# EAGLE design fedpower_mic841_revf (EAGLE 7.2.0)
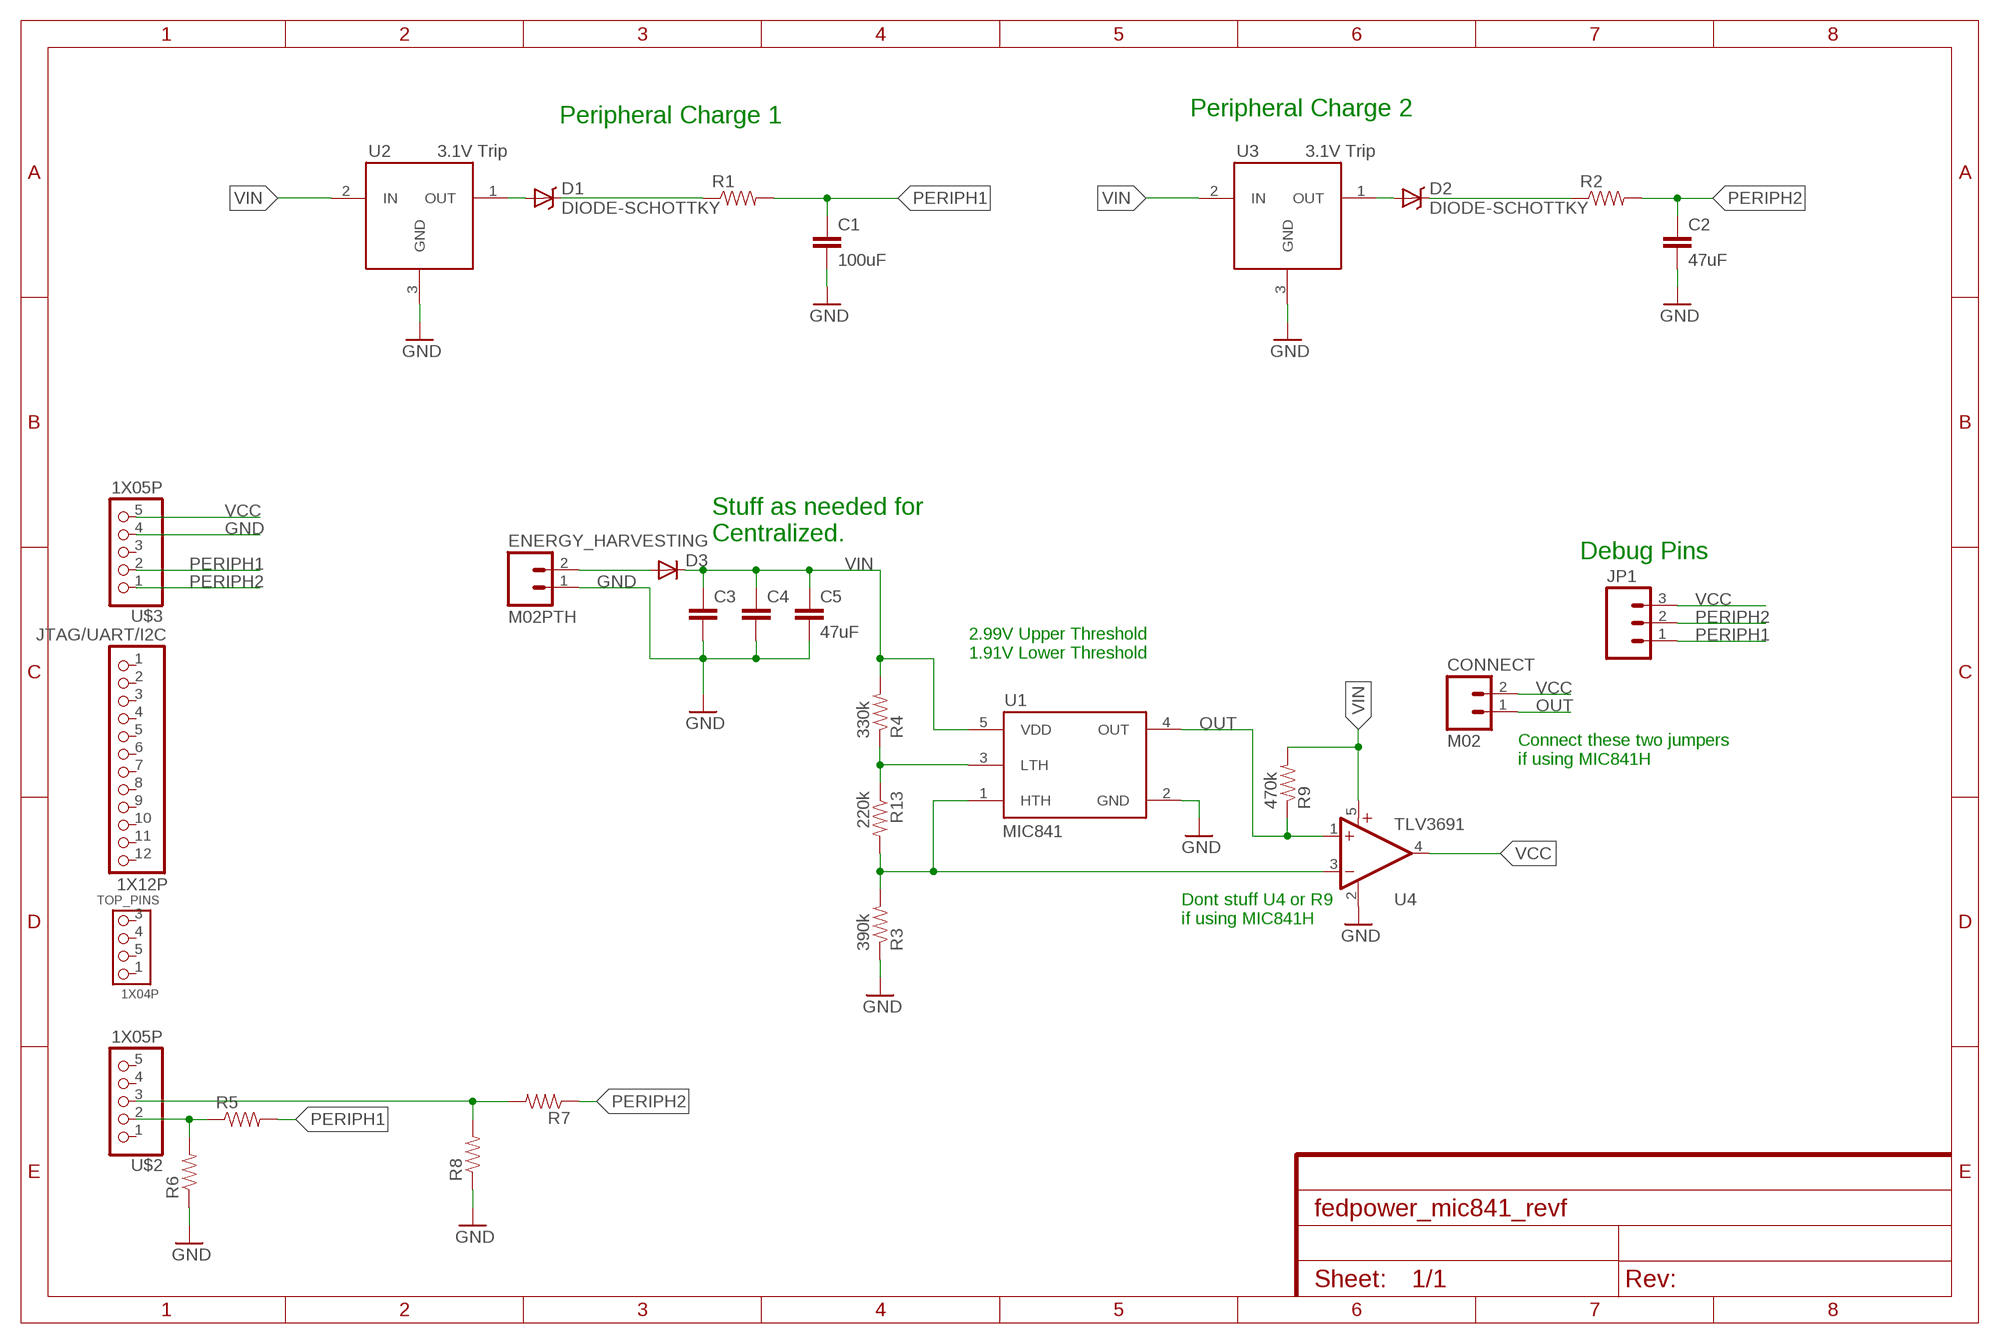
[diagram p0: schematic, sheet 1]
FRAME1 (FRAME-A4L): CNAME: Federated Power Board; CREVISION: C; DESIGNER: Josiah Hester

## Parts
C1  100uF  1.0UF-25V-+80/-20(0805)  [0805]
C2  47uF  1.0UF-25V-+80/-20(0805)  [0805]
C3  1.0UF-25V-+80/-20(0805)  [0805]
C4  1.0UF-25V-+80/-20(0805)  [0805]
C5  47uF  1.0UF-25V-+80/-20(0805)  [0805]
CONNECT  M02  [1X02-1.27MM]
D1  DIODE-SCHOTTKY  [SOD-323]
D2  DIODE-SCHOTTKY  [SOD-323]
D3  DIODESOD  [SOD-323]
ENERGY_HARVESTING  M02PTH  [1X02]
JP1  M03PTH  [1X03]
JTAG/UART/I2C  1X12P  [1X12P]
R1  0.3OHM-1/8W-1%(0805)  [0805]
R2  0.3OHM-1/8W-1%(0805)  [0805]
R3  390k  0.3OHM-1/8W-1%(0805)  [0805]
R4  330k  0.3OHM-1/8W-1%(0805)  [0805]
R5  0.3OHM-1/8W-1%(0805)  [0805]
R6  0.3OHM-1/8W-1%(0805)  [0805]
R7  0.3OHM-1/8W-1%(0805)  [0805]
R8  0.3OHM-1/8W-1%(0805)  [0805]
R9  470k  0.3OHM-1/8W-1%(0805)  [0805]
R13  220k  0.3OHM-1/8W-1%(0805)  [0805]
TOP_PINS  1X04P  [1X04P]
U1  MIC841  [SC70-5]
U2  3.1V Trip  NCP300"  [SOT-23-5_1PRIMARY]
U3  3.1V Trip  NCP300"  [SOT-23-5_1PRIMARY]
U4  TLV3691  [SC70-5]
U$2  1X05P  [1X05P]
U$3  1X05P  [1X05P]

## Nets
GND: C1.2 C2.2 C3.2 C4.2 C5.2 ENERGY_HARVESTING.1 R3.1 R6.1 R8.1 U1.2(GND) U2.3(GND) U3.3(GND) U4.2(GND) U$3.4
N$1: D1.2(A) U2.1(OUT)
N$2: R4.1 R13.1 U1.3(LTH)
N$3: D1.1(C) R1.1
N$4: D2.2(A) U3.1(OUT)
N$5: D3.2(A) ENERGY_HARVESTING.2
N$6: D2.1(C) R2.1
N$7: R3.2 R13.2 U1.1(HTH) U4.3(-IN)
OUT: CONNECT.1 R9.1 U1.4(OUT) U4.1(+IN)
P1.3/C3: R5.1 R6.2 U$2.2
P1.4/C4: R7.2 R8.2 U$2.3
PERIPH1: C1.1 JP1.1 R1.2 R5.2 U$3.2
PERIPH2: C2.1 JP1.2 R2.2 R7.1 U$3.1
VCC: CONNECT.2 JP1.3 U4.4(OUT) U$3.5
VIN: C3.1 C4.1 C5.1 D3.1(C) R4.2 R9.2 U1.5(VDD) U2.2(IN) U3.2(IN) U4.5(V+)
Unconnected: JTAG/UART/I2C.1 JTAG/UART/I2C.2 JTAG/UART/I2C.3 JTAG/UART/I2C.4 JTAG/UART/I2C.5 JTAG/UART/I2C.6 JTAG/UART/I2C.7 JTAG/UART/I2C.8 JTAG/UART/I2C.9 JTAG/UART/I2C.10 JTAG/UART/I2C.11 JTAG/UART/I2C.12 TOP_PINS.1 TOP_PINS.3 TOP_PINS.4 TOP_PINS.5 U2.4(NC) U2.5(NC) U3.4(NC) U3.5(NC) U$2.1 U$2.4 U$2.5 U$3.3

## Notes on the sheet
- Peripheral Charge 1 | Peripheral Charge 2
- Stuff as needed for 
  Centralized.
- Debug Pins
- 2.99V Upper Threshold
  1.91V Lower Threshold
- Connect these two jumpers
  if using MIC841H
- Dont stuff U4 or R9
  if using MIC841H

## Library data of the parts
C1-C5 = SparkFun-Capacitors:1.0UF-25V-+80/-20(0805); PROD_ID: CAP-11625; VALUE: 1.0uF
CONNECT ENERGY_HARVESTING = SparkFun-Connectors:M02: Standard 2-pin 0.1" header. Use with - straight break away headers ( PRT-00116) - right angle break away headers (PRT-00553) - swiss pins (PRT-00743) - machine pins (PRT-00117) - female headers (PRT-00115) Molex polarized connector foot print use with: PRT-08233 with associated crimp pins and housings. 2.54_SCREWTERM for use with PRT-10571. 3.5mm Screw Terminal footprints for PRT-08084 5mm Screw Terminal footprints for use with PRT-08433
D1 D2 = SparkFun-DiscreteSemi:DIODE-SCHOTTKY: Commonly MBRA140.
D3 = SparkFun-DiscreteSemi:DIODE: Diode These are standard reverse protection diodes and small signal diodes. SMA package can handle up to about 1A. SOD-323 can handle about 200mA. What the SOD-323 package when ordering, there are some mfgs out there that are 5-pin packages.; PROD_ID: DIO-09646
JP1 = SparkFun-Connectors:M03: Header 3 Standard 3-pin 0.1" header. Use with straight break away headers (SKU : PRT-00116), right angle break away headers (PRT-00553), swiss pins (PRT-00743), machine pins (PRT-00117), and female headers (PRT-00115). Molex polarized connector foot print use with SKU : PRT-08232 with associated crimp pins and housings.
JTAG/UART/I2C = pinhead_1.27mm:1X12P
R1-R9 R13 = SparkFun-Resistors:0.3OHM-1/8W-1%(0805); PROD_ID: RES-11622; VALUE: 0.3
TOP_PINS = pinhead_1.27mm:1X04P
U1 = fedpower:MIC841: MIC841:Comparator with reference and adj. hysteresis
U2 U3 = Moo1.2:NCP300
U4 = fedpower:TLV3691: 0.9-V to 6.5-V, Nanopower Comparator Datasheets Analog Signal Chain Guide <http://www.ti.com/lit/pdf/slyb174> TLV3691 <http://www.ti.com/lit/ds/symlink/tlv3691.pdf> Manufacturer Product Page TLV3691IDPFR Specifications <http://www.ti.com/general/docs/suppproductinfo.tsp?distId=10&orderablePartNumber=TLV3691IDPFR> Standard Package <javascript:dlgHelp('Standard%20Packaging%20Help');> 1 Category Integrated Circuits (ICs) </product-search/en/integrated-circuits-ics> Family Linear - Comparators </product-search/en/integrated-circuits-ics/linear-comparators/2556221> Series - Packaging <javascript:dlgHelp('Standard%20Packaging%20Help');> Cut Tape (CT) <javascript:dlgHelp('Cut%20Tape%20Help');> Type General Purpose Number of Elements 1 Output Type Push-Pull Voltage - Supply, Single/Dual (±) 0.9 V ~ 6.5 V, ±0.45 V ~ 3.25 V Voltage - Input Offset (Max) 3mV Current - Input Bias (Max) 100pA Current - Output (Typ) 42mA Current - Quiescent (Max) 150nA CMRR, PSRR (Typ) - Propagation Delay (Max) 35µs Hysteresis - Operating Temperature -40°C ~ 125°C Package / Case 6-XFDFN Mounting Type Surface Mount Supplier Device Package 6-X2SON (1x1) Online Catalog Comparators - 1 element </catalog/en/partgroup/comparators-1-element/3112?mpart=TLV3691IDPFR&vendor=296&WT.z_ref_page_type=PS&WT.z_ref_page_sub_type=PD&WT.z_ref_page_id=PD&WT.z_ref_page_event=DC_Link_Table> Other Names 296-37242-1
U$2 U$3 = pinhead_1.27mm:1X05P

## Board
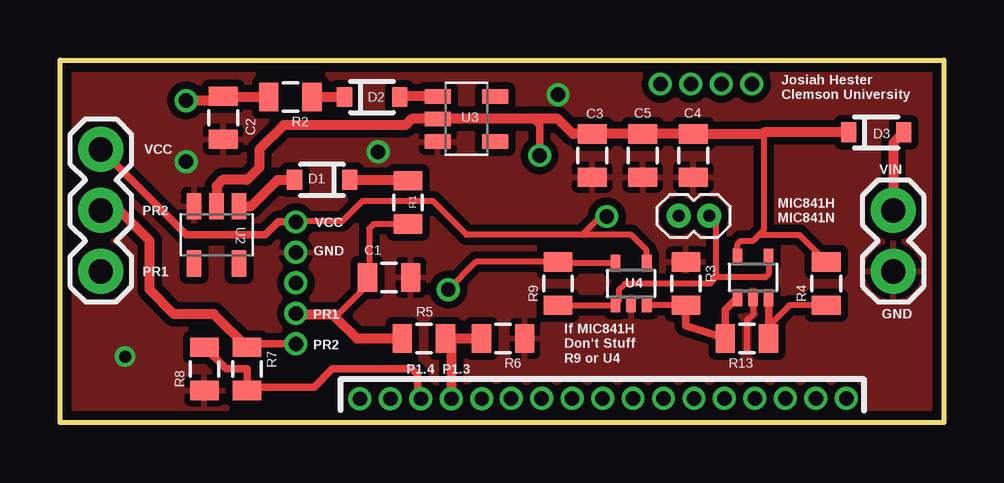
[diagram p1: board, top side]
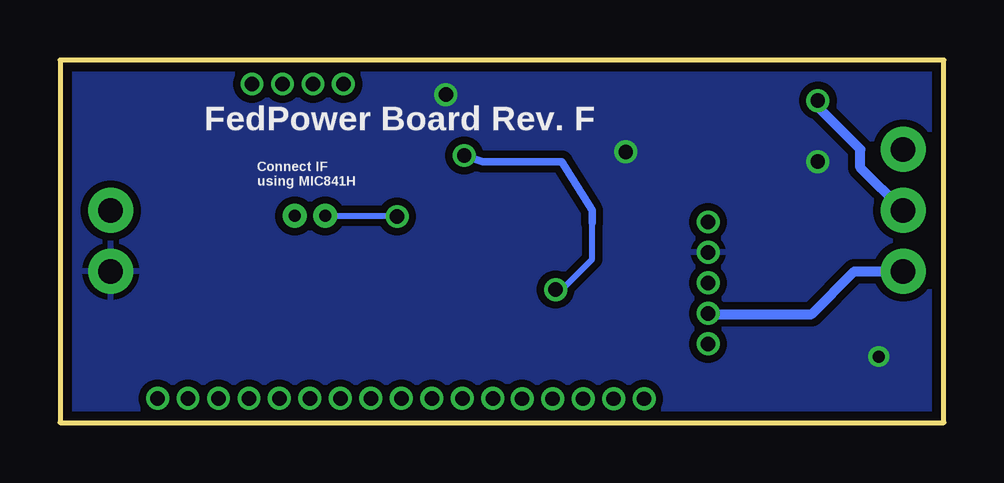
[diagram p2: board, bottom side, seen from below]

Size 36.83 x 15.11 mm. Coordinates in mm from the lower left corner, seen from the top.
Outline: 0,0 0,15.11 36.83,15.11 36.83,0 0,0
Copper layers (1*16): Top 0.0356mm / dielectric 1.5011mm / Bottom 0.0356mm
Design rules "LaenPCBOrder": minimum track width 6mil, minimum drill 13mil, track to track 6mil, track to pad 6mil, pad to pad 6mil, via to via 6mil, smd to smd 6mil, copper to edge 15mil, drill to drill 6mil, minimum pad ring 7mil, minimum via ring 7mil, stop-mask expansion 3mil, vias tented up to drill 0mil, thermal gap 10mil

### Footprints (pad centres in the part's own frame; a part is rotated, then mirrored left to right if it is on the bottom)
0805 = smd 0.8 x 1.2: 1 -0.9,0; 2 0.9,0
1X02-1.27MM = drill 0.508 pad 1: 1 0,0; 2 1.27,0
SOD-323 = smd 0.63 x 0.83: 1 -1.15,0; 2 1.15,0
1X02 = drill 1.016 pad 1.88: 1 0,0; 2 2.54,0
1X03 = drill 1.016 pad 1.88: 1 0,0; 2 2.54,0; 3 5.08,0
1X12P = drill 0.6: 1 -6.985,0.635; 2 -5.715,0.635; 3 -4.445,0.635; 4 -3.175,0.635; 5 -1.905,0.635; 6 -0.635,0.635; 7 0.635,0.635; 8 1.905,0.635; 9 3.175,0.635; 10 4.445,0.635; 11 5.715,0.635; 12 6.985,0.635
1X04P = drill 0.6: 1 1.905,0.635; 3 -1.905,0.635; 4 -0.635,0.635; 5 0.635,0.635
SC70-5 = smd 0.4 x 0.7: 1 -0.65,-0.85; 2 0,-0.85; 3 0.65,-0.85; 4 0.65,0.85; 5 -0.65,0.85
SOT-23-5_1PRIMARY = smd 1.092 x 0.61: 1 -1.194,0.94; 2 -1.194,0; 3 -1.194,-0.94; 4 1.194,-0.94; 5 1.194,0.94
1X05P = drill 0.6: 1 -2.54,0; 2 -1.27,0; 3 0,0; 4 1.27,0; 5 2.54,0

### Placement (x,y rotation side)
C1  13.71,6.05 0 top
C2  6.8,12.71 270 top
C3  22.17,11.13 270 top
C4  26.39,11.13 270 top
C5  24.28,11.13 270 top
CONNECT  27.05,8.62 180 top
D1  10.92,10.12 180 top
D2  13,13.57 0 top
D3  34.01,12.1 0 top
ENERGY_HARVESTING  34.72,6.31 90 top
JP1  1.7,6.31 90 top
JTAG/UART/I2C  25.78,0.38 0 top
R1  14.5,9.18 270 top
R2  9.6,13.57 180 top
R3  26.08,5.8 270 top
R4  31.93,5.8 90 top
R5  15.16,3.51 180 top
R6  18.46,3.51 180 top
R7  7.8,2.24 270 top
R8  6.02,2.24 90 top
R9  20.75,5.8 90 top
R13  28.62,3.51 180 top
TOP_PINS  26.92,13.48 0 top
U1  28.88,6.05 0 top
U2  6.53,7.83 270 top
U3  16.94,12.66 0 top
U4  23.8,5.8 0 top
U$2  15.03,1 180 top
U$3  9.83,5.82 90 top

### Tracks (layer width: path | path; a pad name or v marks a point on that pad's centre or on a via)
GND  (via drill 0.5, 0.6)
  Top 0.254: U1.2 28.88,4.53 28.62,4.27 28.62,3
  other vias: 20.75,13.67 5.26,10.88 2.72,2.75 13.26,11.29
  pour Top (isolate 0.305): 0,0.25 0,15.11 36.83,15.24 36.83,0.38
  pour Bottom (isolate 0.305): 0,0.38 0,14.99 36.83,14.99 36.83,0.38
N$1
  Top 0.406: U2.1 7.97,9.02 9.07,10.12 D1.2
N$2
  Top 0.254: R4.1 30.4,4.9 29.52,4.02
  Top 0.305: U1.3 29.52,4.02 R13.1
N$3
  Top 0.406: D1.1 14.46,10.12 R1.1
N$4
  Top 0.406: U3.1 14.18,13.6 D2.2
N$5
  Top 0.406: D3.2 34.72,11.66 ENERGY_HARVESTING.2
N$6
  Top 0.406: D2.1 R2.1
N$7
  Top 0.254: R3.2 24.5,4.9 U4.3
  Top 0.305: R3.2 26.07,4.05 R13.2 27.72,4.7 U1.1
OUT
  Top 0.254: U1.4 29.53,6.19 29.39,6.05 27.35,6.05 | 27.35,6.05 27.1,5.8 23.54,5.8 23.29,5.54 23.29,5.09 U4.1 23.1,4.9 R9.1 | 27.35,6.05 27.35,8.31 CONNECT.1
P1.3/C3
  Top 0.406: U$2.2 16.3,3.27 R5.1 R6.2
P1.4/C4
  Top 0.305: R8.2 6.92,2.24 7.8,2.24 R7.2 7.93,1.48 10.59,1.48 11.35,2.24 14.65,2.24 14.91,1.99 14.91,1.12 U$2.3
PERIPH1
  Top 0.254: R1.2 13.07,8.28 12.88,8.08 12.88,6.11 C1.1 | 12.72,5.89 12.72,5.65 11.48,4.4
  Top 0.406: 12.72,5.89 C1.1 12.88,6.37 | U$3.2 9.85,4.53 11.35,4.53 11.48,4.4 12.37,3.51 R5.2
  Bottom 0.406: U$3.2 9.8,4.53 5.51,4.53 3.73,6.31 JP1.1
PERIPH2  (via drill 0.6)
  Top 0.305: R7.1 7.94,3.28 U$3.1
  Top 0.406: R2.2 6.84,13.57 | 6.84,13.57 C2.1 | R7.1 6.41,4.53 4.75,4.53 3.73,5.54 3.73,7.58 2.46,8.85 JP1.2 | 6.84,13.57 6.69,13.42 v5.26,13.42
  Bottom 0.406: JP1.2 3.48,10.62 3.48,11.39 5.26,13.16 v5.26,13.42
VCC  (via drill 0.6)
  Top 0.254: U$3.5 9.85,8.39 11.76,8.39 12.6,9.23 15.54,9.23 16.94,7.83 21.77,7.83 | U4.4 24.45,7.18 23.8,7.83 21.77,7.83 | v22.78,8.59 22.53,8.59 21.77,7.83
  Top 0.305: U$3.5 9.09,8.36 8.56,7.83 5.26,7.83 JP1.3
  Bottom 0.254: CONNECT.2 22.81,8.62 v22.78,8.59
VIN  (via drill 0.6)
  Top 0.254: 16.4,5.77 v16.18,5.54 17.33,6.7 R9.2 20.8,6.65 U4.5 | U1.5 28.23,7.43 28.37,7.58 28.88,7.58 29.13,7.83 | 29.13,7.83 30.79,7.83 R4.2 | 29.32,12.03 29.32,8.02 29.13,7.83
  Top 0.305: v19.99,11.13 19.99,12.4 19.73,12.66
  Top 0.406: D3.1 29.39,12.1 | 29.39,12.1 29.33,12.1 | 29.39,12.1 29.32,12.03 C4.1 C5.1 C3.1 21.37,12.03 20.75,12.66 19.73,12.66 U3.2 14.65,12.66 14.4,12.4 9.32,12.4 8.3,11.39 8.3,10.62 7.8,10.12 6.78,10.12 6.53,9.86 U2.2
  Bottom 0.254: v16.18,5.54 15.92,5.54 14.65,6.81 14.65,8.34
  Bottom 0.305: 14.65,8.34 14.65,8.85 15.92,10.88 19.23,10.88 v19.99,11.13

### Text on the board
tPlace: Josiah Hester / Clemson University | VCC | VIN | PR2 | VCC | MIC841H / MIC841N | GND | PR1 | U4 | PR1 | GND | PR2 | If MIC841H / Don't Stuff / R9 or U4 | P1.4 | P1.3
bPlace: FedPower Board Rev. F | Connect IF / using MIC841H